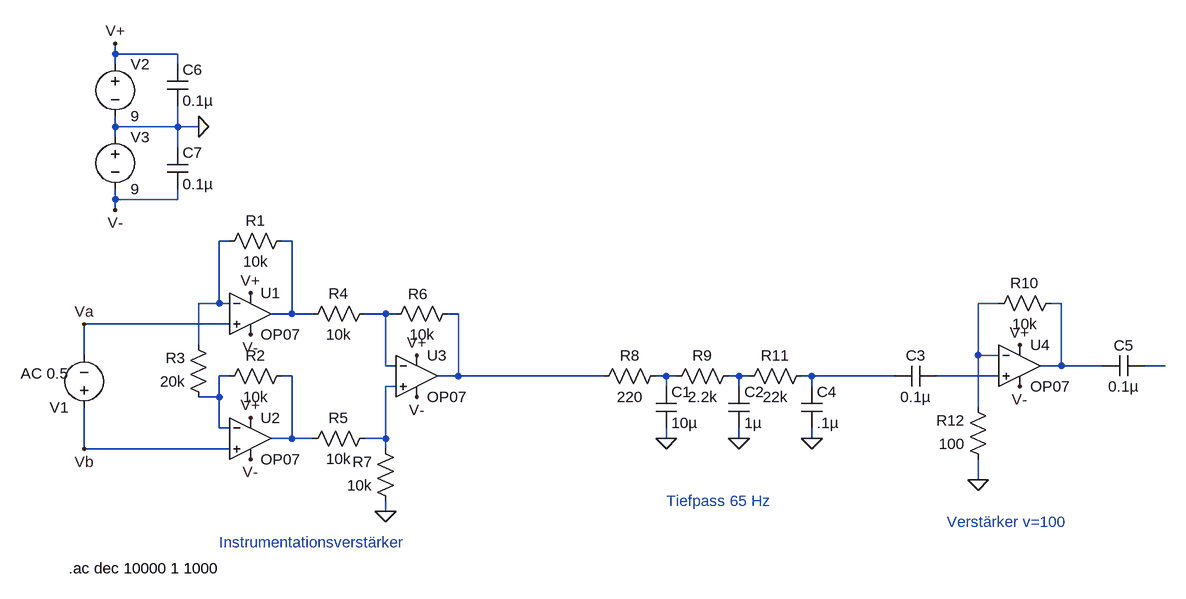
[diagram p0: schematic ekg_v1.asc]
ekg_v1.asc, the LTspice schematic file:
Version 4
SHEET 1 2052 680
WIRE 432 -256 432 -272
WIRE 528 -256 432 -256
WIRE 432 -240 432 -256
WIRE 528 -240 528 -256
WIRE 432 -144 432 -160
WIRE 528 -144 528 -176
WIRE 528 -144 432 -144
WIRE 560 -144 528 -144
WIRE 432 -128 432 -144
WIRE 528 -112 528 -144
WIRE 432 -32 432 -48
WIRE 528 -32 528 -48
WIRE 528 -32 432 -32
WIRE 432 -16 432 -32
WIRE 608 32 592 32
WIRE 704 32 688 32
WIRE 592 128 592 32
WIRE 592 128 560 128
WIRE 608 128 592 128
WIRE 1792 128 1760 128
WIRE 1888 128 1872 128
WIRE 704 144 704 32
WIRE 704 144 672 144
WIRE 736 144 704 144
WIRE 848 144 816 144
WIRE 864 144 848 144
WIRE 960 144 944 144
WIRE 608 160 384 160
WIRE 560 192 560 128
WIRE 384 208 384 160
WIRE 1760 208 1760 128
WIRE 1792 208 1760 208
WIRE 848 224 848 144
WIRE 864 224 848 224
WIRE 1888 224 1888 128
WIRE 1888 224 1856 224
WIRE 1952 224 1888 224
WIRE 2048 224 2016 224
WIRE 608 240 592 240
WIRE 704 240 688 240
WIRE 960 240 960 144
WIRE 960 240 928 240
WIRE 1184 240 960 240
WIRE 1280 240 1264 240
WIRE 1296 240 1280 240
WIRE 1392 240 1376 240
WIRE 1408 240 1392 240
WIRE 1504 240 1488 240
WIRE 1632 240 1504 240
WIRE 1792 240 1696 240
WIRE 864 256 848 256
WIRE 1280 256 1280 240
WIRE 1392 256 1392 240
WIRE 1504 256 1504 240
WIRE 592 272 592 240
WIRE 592 272 560 272
WIRE 1760 288 1760 208
WIRE 592 320 592 272
WIRE 608 320 592 320
WIRE 704 336 704 240
WIRE 704 336 672 336
WIRE 736 336 704 336
WIRE 848 336 848 256
WIRE 848 336 816 336
WIRE 1280 336 1280 320
WIRE 1392 336 1392 320
WIRE 1504 336 1504 320
WIRE 384 352 384 288
WIRE 608 352 384 352
WIRE 848 352 848 336
WIRE 1760 400 1760 368
WIRE 848 448 848 432
FLAG 848 448 0
FLAG 432 -272 V+
FLAG 640 176 V-
FLAG 640 368 V-
FLAG 896 272 V-
FLAG 560 -144 0
FLAG 432 -16 V-
FLAG 640 112 V+
FLAG 896 208 V+
FLAG 640 304 V+
FLAG 1280 336 0
FLAG 1392 336 0
FLAG 1504 336 0
FLAG 1760 400 0
FLAG 1824 192 V+
FLAG 1824 256 V-
FLAG 384 160 Va
FLAG 384 352 Vb
SYMBOL OpAmps\\OP07 640 80 R0
SYMATTR InstName U1
SYMBOL OpAmps\\OP07 640 272 R0
SYMATTR InstName U2
SYMBOL OpAmps\\OP07 896 176 R0
SYMATTR InstName U3
SYMBOL res 704 224 R90
WINDOW 0 0 56 VBottom 2
WINDOW 3 32 56 VTop 2
SYMATTR InstName R2
SYMATTR Value 10k
SYMBOL res 704 16 R90
WINDOW 0 0 56 VBottom 2
WINDOW 3 32 56 VTop 2
SYMATTR InstName R1
SYMATTR Value 10k
SYMBOL res 576 288 R180
WINDOW 0 36 76 Left 2
WINDOW 3 36 40 Left 2
SYMATTR InstName R3
SYMATTR Value 20k
SYMBOL res 832 128 R90
WINDOW 0 0 56 VBottom 2
WINDOW 3 32 56 VTop 2
SYMATTR InstName R4
SYMATTR Value 10k
SYMBOL res 832 320 R90
WINDOW 0 0 56 VBottom 2
WINDOW 3 32 56 VTop 2
SYMATTR InstName R5
SYMATTR Value 10k
SYMBOL res 960 128 R90
WINDOW 0 1 62 VBottom 2
WINDOW 3 32 56 VTop 2
SYMATTR InstName R6
SYMATTR Value 10k
SYMBOL res 864 448 R180
WINDOW 0 36 76 Left 2
WINDOW 3 36 40 Left 2
SYMATTR InstName R7
SYMATTR Value 10k
SYMBOL voltage 384 304 R180
WINDOW 123 24 68 Left 2
WINDOW 39 0 0 Left 0
SYMATTR Value2 AC 0.5
SYMATTR InstName V1
SYMATTR Value ""
SYMBOL voltage 432 -256 R0
WINDOW 123 0 0 Left 0
WINDOW 39 0 0 Left 0
SYMATTR InstName V2
SYMATTR Value 9
SYMBOL voltage 432 -144 R0
SYMATTR InstName V3
SYMATTR Value 9
SYMBOL res 1280 224 R90
WINDOW 0 0 56 VBottom 2
WINDOW 3 32 56 VTop 2
SYMATTR InstName R8
SYMATTR Value 220
SYMBOL res 1392 224 R90
WINDOW 0 0 56 VBottom 2
WINDOW 3 32 56 VTop 2
SYMATTR InstName R9
SYMATTR Value 2.2k
SYMBOL cap 1264 256 R0
SYMATTR InstName C1
SYMATTR Value 10µ
SYMBOL cap 1376 256 R0
SYMATTR InstName C2
SYMATTR Value 1µ
SYMBOL res 1504 224 R90
WINDOW 0 0 56 VBottom 2
WINDOW 3 32 56 VTop 2
SYMATTR InstName R11
SYMATTR Value 22k
SYMBOL cap 1488 256 R0
SYMATTR InstName C4
SYMATTR Value .1µ
SYMBOL OpAmps\\OP07 1824 160 R0
SYMATTR InstName U4
SYMBOL res 1888 112 R90
WINDOW 0 0 56 VBottom 2
WINDOW 3 32 56 VTop 2
SYMATTR InstName R10
SYMATTR Value 10k
SYMBOL res 1776 384 R180
WINDOW 0 36 76 Left 2
WINDOW 3 36 40 Left 2
SYMATTR InstName R12
SYMATTR Value 100
SYMBOL cap 1696 224 R90
WINDOW 0 0 32 VBottom 2
WINDOW 3 32 32 VTop 2
SYMATTR InstName C3
SYMATTR Value 0.1µ
SYMBOL cap 2016 208 R90
WINDOW 0 0 32 VBottom 2
WINDOW 3 32 32 VTop 2
SYMATTR InstName C5
SYMATTR Value 0.1µ
SYMBOL cap 512 -240 R0
SYMATTR InstName C6
SYMATTR Value 0.1µ
SYMBOL cap 512 -112 R0
SYMATTR InstName C7
SYMATTR Value 0.1µ
TEXT 592 496 Left 2 ;Instrumentationsverstärker
TEXT 360 536 Left 2 !.ac dec 10000 1 1000
TEXT 1280 432 Left 2 ;Tiefpass 65 Hz
TEXT 1712 464 Left 2 ;Verstärker v=100

The netlist it stands for:
* ekg_v1.asc
XU1 Va N001 V+ V- N002 LT1001  ; OP07, pins In+ In- V+ V- OUT
XU2 Vb N008 V+ V- N009 LT1001  ; OP07, pins In+ In- V+ V- OUT
XU3 N014 N005 V+ V- N006 LT1001  ; OP07, pins In+ In- V+ V- OUT
R2 N009 N008 10k
R1 N002 N001 10k
R3 N008 N001 20k
R4 N005 N002 10k
R5 N014 N009 10k
R6 N006 N005 10k
R7 0 N014 10k
V1 Vb Va AC 0.5
V2 V+ 0 9
V3 0 V- 9
R8 N010 N006 220
R9 N011 N010 2.2k
C1 N010 0 10µ
C2 N011 0 1µ
R11 N012 N011 22k
C4 N012 0 .1µ
XU4 N013 N003 V+ V- N004 LT1001  ; OP07, pins In+ In- V+ V- OUT
R10 N004 N003 10k
R12 0 N003 100
C3 N013 N012 0.1µ
C5 N007 N004 0.1µ
C6 V+ 0 0.1µ
C7 0 V- 0.1µ
* Instrumentationsverstärker
.ac dec 10000 1 1000
* Tiefpass 65 Hz
* Verstärker v=100
.lib LTC.lib
.backanno
.end